# EAGLE schematic olmRTCbreakout (EAGLE 6.5.0)
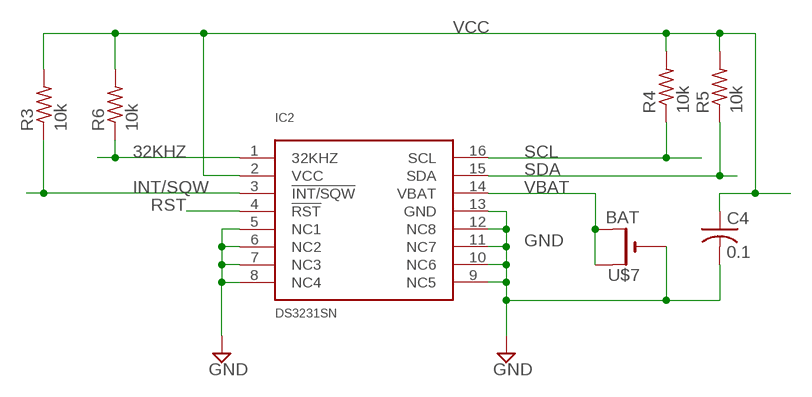
[diagram p0: schematic, sheet 1]

## Parts
C4  0.1  C-USC0805K  [C0805K]
IC2  DS3231SN  [SO16W]
R3  10k  R-US_R0805  [R0805]
R4  10k  R-US_R0805  [R0805]
R5  10k  R-US_R0805  [R0805]
R6  10k  R-US_R0805  [R0805]
U$7  BAT  CR1220SMT  [CR1220-SMD]

## Nets
32KHZ: IC2.1(32KHZ) R6.1
GND: C4.2 IC2.5(NC1) IC2.6(NC2) IC2.7(NC3) IC2.8(NC4) IC2.9(NC5) IC2.10(NC6) IC2.11(NC7) IC2.12(NC8) IC2.13(GND) U$7.-
INT/SQW: IC2.3(!INT/SQW) R3.1
RST: IC2.4(!RST)
SCL: IC2.16(SCL) R4.1
SDA: IC2.15(SDA) R5.1
VBAT: IC2.14(VBAT) U$7.+$1(+) U$7.+$2(+1)
VCC: C4.1 IC2.2(VCC) R3.2 R4.2 R5.2 R6.2

## Library data of the parts
C4 = adafruit:C-US: CAPACITOR, American symbol
IC2 = comfile:DS3231SN
R3-R6 = adafruit:R-US_: RESISTOR, American symbol
U$7 = adafruit:CR1220: CR1216/CR1220/CR1225 12mm 3V lithium coin cell Great for battery packup. Both SMT and THM holders. Note the THM package has the ground pads on both sides of the PCB so that the masks are the same - this reduces the cost